# Altium schematic sheet TransistorArray.SchDoc: Наименование
size 420 x 297 mm; ApprovedBy: Сидоров; CheckedBy: Петров; Author: Иванов; CompanyName: РГППУ; Title2str: Изделия; DecimalNumber: АБВГ.123456.001 33
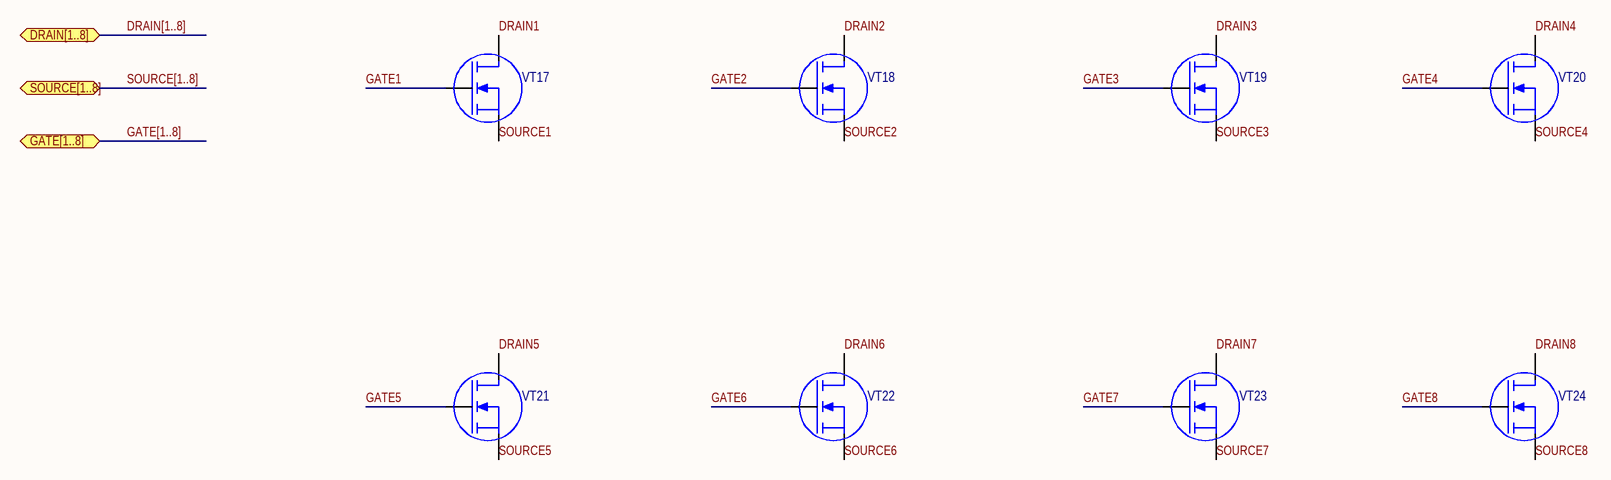
[diagram p0: TransistorArray.SchDoc]

## Parts
VT17  2N7002  [SOT23 (TO-236AB)]  (value not drawn)
VT18  2N7002  [SOT23 (TO-236AB)]  (value not drawn)
VT19  2N7002  [SOT23 (TO-236AB)]  (value not drawn)
VT20  2N7002  [SOT23 (TO-236AB)]  (value not drawn)
VT21  2N7002  [SOT23 (TO-236AB)]  (value not drawn)
VT22  2N7002  [SOT23 (TO-236AB)]  (value not drawn)
VT23  2N7002  [SOT23 (TO-236AB)]  (value not drawn)
VT24  2N7002  [SOT23 (TO-236AB)]  (value not drawn)

## Ports
DRAIN[1..8], GATE[1..8], SOURCE[1..8]

## Nets
DRAIN1: VT17.3(D)
DRAIN2: VT18.3(D)
DRAIN3: VT19.3(D)
DRAIN4: VT20.3(D)
DRAIN5: VT21.3(D)
DRAIN6: VT22.3(D)
DRAIN7: VT23.3(D)
DRAIN8: VT24.3(D)
GATE1: VT17.1(G)
GATE2: VT18.1(G)
GATE3: VT19.1(G)
GATE4: VT20.1(G)
GATE5: VT21.1(G)
GATE6: VT22.1(G)
GATE7: VT23.1(G)
GATE8: VT24.1(G)
SOURCE1: VT17.2(S)
SOURCE2: VT18.2(S)
SOURCE3: VT19.2(S)
SOURCE4: VT20.2(S)
SOURCE5: VT21.2(S)
SOURCE6: VT22.2(S)
SOURCE7: VT23.2(S)
SOURCE8: VT24.2(S)

## Buses and harness runs
bus DRAIN[1..8] = port DRAIN[1..8]
bus GATE[1..8] = port GATE[1..8]
bus SOURCE[1..8] = port SOURCE[1..8]

## Notes on the sheet
- Изм.
- Лист
- N*докум.
- Подп.
- Дата
- Лит.
- Масса
- Масштаб
- Разраб.
- Пров.
- Т.контр.
- Лиcт
- Лиcтов
- Н.контр.
- Утв.

## Library data of the parts
VT17-VT24 = 2N7002 n-MOSFET: 60V, 300mA N-channel Trench MOSFET; ManufacturerPartNumber: 2N7002